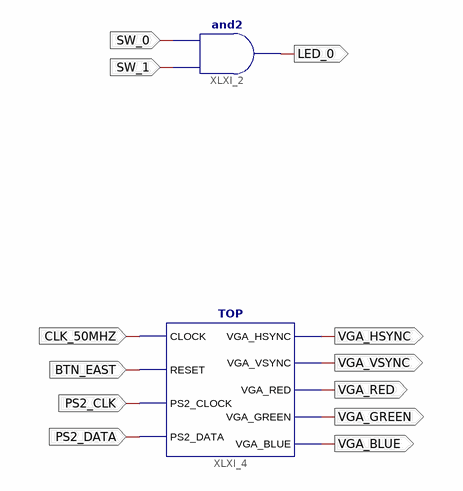
[diagram p0: schematic sheet 1]
// Xilinx ISE schematic TOP0.sch (spartan3e) as structural Verilog: 2 symbols, 12 ports
module TOP0 (
  input  SW_0,
  input  SW_1,
  input  CLK_50MHZ,
  input  BTN_EAST,
  input  PS2_CLK,
  input  PS2_DATA,
  output VGA_GREEN,
  output VGA_VSYNC,
  output VGA_HSYNC,
  output LED_0,
  output VGA_RED,
  output VGA_BLUE
);

  and XLXI_2 (LED_0, SW_1, SW_0);
  TOP XLXI_4 (
    .CLOCK(CLK_50MHZ), .RESET(BTN_EAST), .PS2_CLOCK(PS2_CLK), .PS2_DATA(PS2_DATA), .VGA_HSYNC(VGA_HSYNC),
    .VGA_VSYNC(VGA_VSYNC), .VGA_RED(VGA_RED), .VGA_GREEN(VGA_GREEN), .VGA_BLUE(VGA_BLUE));
endmodule
